# Altium project Radio_Motherboard.PrjPcb
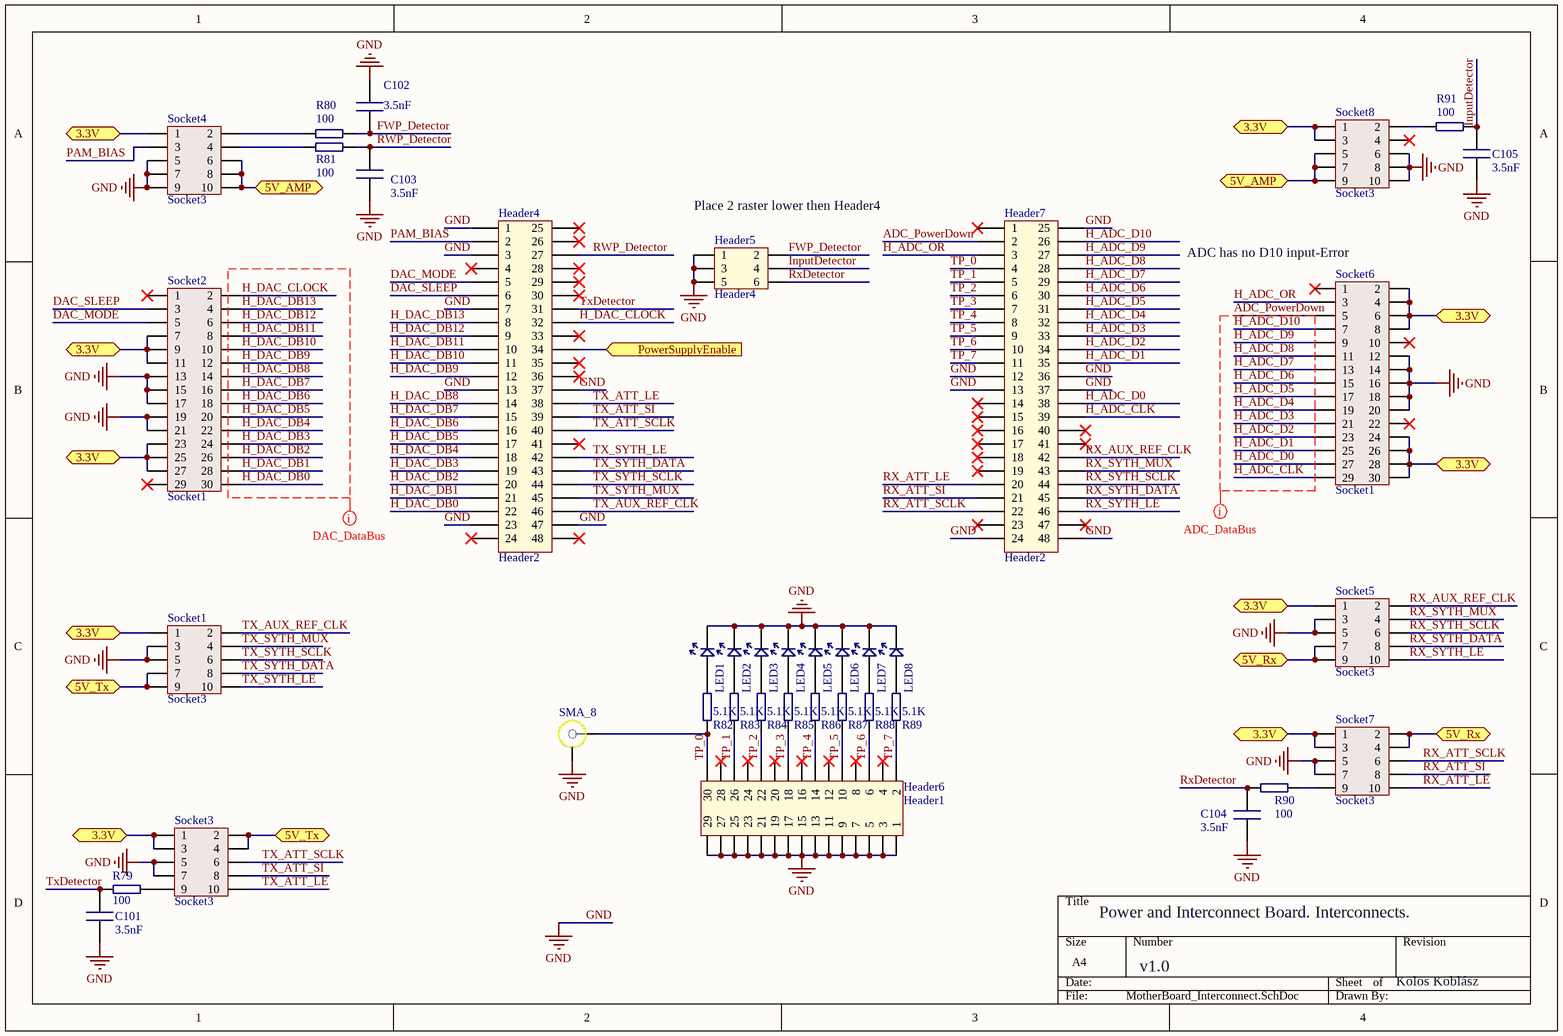
[diagram p0: MotherBoard_Interconnect.SchDoc]
2 sheets, 105 parts. Net scope: flat (ports and power ports of the same name join across sheets).
Board file: PCB_Motherboard.PcbDoc
Sheets:
  MotherBoard_Interconnect.SchDoc
  MotherBoard_PowerSupply.SchDoc

## Sheet MotherBoard_Interconnect.SchDoc
size A4; DocumentNumber: 3; SheetNumber: 3; SheetTotal: 9

### Parts
C101  value 3.5nF  [0805 SMD Passive]  (hidden comment: Cap1)
C102  value 3.5nF  [0805 SMD Passive]  (hidden comment: Cap1)
C103  value 3.5nF  [0805 SMD Passive]  (hidden comment: Cap1)
C104  value 3.5nF  [0805 SMD Passive]  (hidden comment: Cap1)
C105  value 3.5nF  [0805 SMD Passive]  (hidden comment: Cap1)
Header4  Header2  [Header2]
Header5  Header4  [Header4]
Header6  Header1  [Header1]
Header7  Header2  [Header2]
LED1  TP0  [0805 SMD Passive]  (value not drawn)
LED2  TP1  [0805 SMD Passive]  (value not drawn)
LED3  TP2  [0805 SMD Passive]  (value not drawn)
LED4  TP3  [0805 SMD Passive]  (value not drawn)
LED5  TP4  [0805 SMD Passive]  (value not drawn)
LED6  TP5  [0805 SMD Passive]  (value not drawn)
LED7  TP6  [0805 SMD Passive]  (value not drawn)
LED8  TP7  [0805 SMD Passive]  (value not drawn)
R79  value 100  [0805 SMD Passive]  (hidden comment: Resistor)
R80  value 100  [0805 SMD Passive]  (hidden comment: Resistor)
R81  value 100  [0805 SMD Passive]  (hidden comment: Resistor)
R82  value 5.1K  [0805 SMD Passive]  (hidden comment: Resistor)
R83  value 5.1K  [0805 SMD Passive]  (hidden comment: Resistor)
R84  value 5.1K  [0805 SMD Passive]  (hidden comment: Resistor)
R85  value 5.1K  [0805 SMD Passive]  (hidden comment: Resistor)
R86  value 5.1K  [0805 SMD Passive]  (hidden comment: Resistor)
R87  value 5.1K  [0805 SMD Passive]  (hidden comment: Resistor)
R88  value 5.1K  [0805 SMD Passive]  (hidden comment: Resistor)
R89  value 5.1K  [0805 SMD Passive]  (hidden comment: Resistor)
R90  value 100  [0805 SMD Passive]  (hidden comment: Resistor)
R91  value 100  [0805 SMD Passive]  (hidden comment: Resistor)
SMA_8  SMA_2  [SMA_Board]  (value not drawn)
Socket1  Socket3  [Socket3]
Socket2  Socket1  [Socket1]
Socket3  Socket3  [Socket3]
Socket4  Socket3  [Socket3]
Socket5  Socket3  [Socket3]
Socket6  Socket1  [Socket1]
Socket7  Socket3  [Socket3]
Socket8  Socket3  [Socket3]

### Ports
3.3V, 5V_AMP, 5V_Rx, 5V_Tx, PowerSupplyEnable

### Nets
GND: C101.2 C102.2 C103.2 C104.2 C105.2 Header4.1 Header4.3 Header4.7 Header4.13 Header4.23 Header4.37 Header4.47 Header5.1 Header5.3 Header5.5 Header6.1 Header6.3 Header6.5 Header6.7 Header6.9 Header6.11 Header6.13 Header6.15 Header6.17 Header6.19 Header6.21 Header6.23 Header6.25 Header6.27 Header6.29 Header7.12 Header7.13 Header7.24 Header7.25 Header7.36 Header7.37 Header7.48 LED1.1(K) LED2.1(K) LED3.1(K) LED4.1(K) LED5.1(K) LED6.1(K) LED7.1(K) LED8.1(K) SMA_8.2 Socket1.3 Socket1.5 Socket2.13 Socket2.15 Socket2.17 Socket2.19 Socket2.21 Socket3.5 Socket3.7 Socket4.5 Socket4.7 Socket4.9 Socket5.3 Socket5.5 Socket6.12 Socket6.14 Socket6.16 Socket6.18 Socket6.20 Socket7.5 Socket7.7 Socket8.6 Socket8.8 Socket8.10
3.3V: Socket1.1 Socket2.7 Socket2.9 Socket2.11 Socket2.23 Socket2.25 Socket2.27 Socket3.1 Socket3.3 Socket4.1 Socket5.1 Socket6.2 Socket6.4 Socket6.6 Socket6.8 Socket6.24 Socket6.26 Socket6.28 Socket6.30 Socket7.1 Socket7.3 Socket8.1 Socket8.3 ; port 3.3V
5V_Amp: Socket4.6 Socket4.8 Socket4.10 Socket8.5 Socket8.7 Socket8.9 ; port 5V_AMP
5V_Rx: Socket5.7 Socket5.9 Socket7.2 Socket7.4 ; port 5V_Rx
5V_Tx: Socket1.7 Socket1.9 Socket3.2 Socket3.4 ; port 5V_Tx
ADC_PowerDown: Header7.2 Socket6.5
DAC_MODE: Header4.5 Socket2.5
DAC_SLEEP: Header4.6 Socket2.3
FWP_Detector: C102.1 Header5.2 R80.2
H_ADC_CLK: Header7.39 Socket6.29
H_ADC_D0: Header7.38 Socket6.27
H_ADC_D1: Header7.35 Socket6.25
H_ADC_D2: Header7.34 Socket6.23
H_ADC_D3: Header7.33 Socket6.21
H_ADC_D4: Header7.32 Socket6.19
H_ADC_D5: Header7.31 Socket6.17
H_ADC_D6: Header7.30 Socket6.15
H_ADC_D7: Header7.29 Socket6.13
H_ADC_D8: Header7.28 Socket6.11
H_ADC_D9: Header7.27 Socket6.9
H_ADC_D10: Header7.26 Socket6.7
H_ADC_OR: Header7.3 Socket6.3
H_DAC_CLOCK: Header4.32 Socket2.2
H_DAC_DB0: Header4.22 Socket2.30
H_DAC_DB1: Header4.21 Socket2.28
H_DAC_DB2: Header4.20 Socket2.26
H_DAC_DB3: Header4.19 Socket2.24
H_DAC_DB4: Header4.18 Socket2.22
H_DAC_DB5: Header4.17 Socket2.20
H_DAC_DB6: Header4.16 Socket2.18
H_DAC_DB7: Header4.15 Socket2.16
H_DAC_DB8: Header4.14 Socket2.14
H_DAC_DB9: Header4.12 Socket2.12
H_DAC_DB10: Header4.11 Socket2.10
H_DAC_DB11: Header4.10 Socket2.8
H_DAC_DB12: Header4.9 Socket2.6
H_DAC_DB13: Header4.8 Socket2.4
InputDetector: C105.1 Header5.4 R91.1
PAM_BIAS: Header4.2 Socket4.3
RWP_Detector: C103.1 Header4.27 R81.2
RX_ATT_LE: Header7.20 Socket7.10
RX_ATT_SCLK: Header7.22 Socket7.6
RX_ATT_SI: Header7.21 Socket7.8
RX_AUX_REF_CLK: Header7.42 Socket5.2
RX_SYTH_DATA: Header7.45 Socket5.8
RX_SYTH_LE: Header7.46 Socket5.10
RX_SYTH_MUX: Header7.43 Socket5.4
RX_SYTH_SCLK: Header7.44 Socket5.6
RxDetector: C104.1 Header5.6 R90.1
TP_0: Header6.30 Header7.4 R82.1 SMA_8.1
TP_1: Header6.26 Header7.5 R83.1
TP_2: Header6.22 Header7.6 R84.1
TP_3: Header6.18 Header7.7 R85.1
TP_4: Header6.14 Header7.8 R86.1
TP_5: Header6.10 Header7.9 R87.1
TP_6: Header6.6 Header7.10 R88.1
TP_7: Header6.2 Header7.11 R89.1
TX_ATT_LE: Header4.38 Socket3.10
TX_ATT_SCLK: Header4.40 Socket3.6
TX_ATT_SI: Header4.39 Socket3.8
TX_AUX_REF_CLK: Header4.46 Socket1.2
TX_SYTH_DATA: Header4.43 Socket1.8
TX_SYTH_LE: Header4.42 Socket1.10
TX_SYTH_MUX: Header4.45 Socket1.4
TX_SYTH_SCLK: Header4.44 Socket1.6
TxDetector: C101.1 Header4.31 R79.1
NetHeader4_34: Header4.34 ; port PowerSupplyEnable
NetLED1_2: LED1.2(A) R82.2
NetLED2_2: LED2.2(A) R83.2
NetLED3_2: LED3.2(A) R84.2
NetLED4_2: LED4.2(A) R85.2
NetLED5_2: LED5.2(A) R86.2
NetLED6_2: LED6.2(A) R87.2
NetLED7_2: LED7.2(A) R88.2
NetLED8_2: LED8.2(A) R89.2
NetR79_2: R79.2 Socket3.9
NetR80_1: R80.1 Socket4.2
NetR81_1: R81.1 Socket4.4
NetR90_2: R90.2 Socket7.9
NetR91_2: R91.2 Socket8.2

Not connected (* = marked no-connect by the designer): Header4 4* 24* 25* 26* 28* 29* 30* 33* 35* 36* 41* 48*; Header6 4* 8* 12* 16* 20* 24* 28*; Header7 1* 14* 15* 16* 17* 18* 19* 23* 40* 41* 47*; Socket2 1* 29*; Socket6 1* 10* 22*; Socket8 4*

### Layout directives
net class ADC_DataBus: ADC_PowerDown, H_ADC_CLK, H_ADC_D0, H_ADC_D1, H_ADC_D2, H_ADC_D3, H_ADC_D4, H_ADC_D5, H_ADC_D6, H_ADC_D7, H_ADC_D8, H_ADC_D9, H_ADC_D10
net class DAC_DataBus: H_DAC_CLOCK, H_DAC_DB0, H_DAC_DB1, H_DAC_DB2, H_DAC_DB3, H_DAC_DB4, H_DAC_DB5, H_DAC_DB6, H_DAC_DB7, H_DAC_DB8, H_DAC_DB9, H_DAC_DB10, H_DAC_DB11, H_DAC_DB12, H_DAC_DB13

### Notes on the sheet
- (near Header5) Place 2 raster lower then Header4
- (near Socket6) ADC has no D10 input-Error
- Power and Interconnect Board. Interconnects.
- v1.0
- Kolos Koblász

### Library data of the parts
C101-C105 = Cap1: SMD Capacitor; Precision: 1%; MaxVolt: 16V; FootPrint: *
Header4 Header7 = Header2: 48 Pin Header; PinNumber: 48; Row: 2; Pitch: 2.54mm; Type: 180°; Digi Key Order Code: 3M156386-48-ND
Header5 = Header4: 6pin DIL header; PinNumber: 6; Row: 2; Pitch: 2.54mm; Type: Straight
Header6 = Header1: 29 Pin Header; PartNumber: TLW-115-01-G-D-002-RA; Manufacterer: Samtec; PinNumber: 29; Row: 2; Pitch: 2.54mm; Type: 90°
LED1 LED8 = LED_Green: Diode; Manufacturer: LITEON; Partnumber: LTST-C171KGKT; Type: Green; MaxForwardCurrent: 30mA; MaxRevVoltage: 5V; ForwardCurrent: 20mA; ForwardVoltage: 2V; OrderCode: 160-1426-1-ND; Footprint: 0805
LED2-LED7 = LED_Green: Diode; Manufacturer: LITEON; Partnumber: LTST-C171KGKT; Type: Green; OrderCode: 160-1426-1-ND; MaxForwardCurrent: 30mA; MaxRevVoltage: 5V; ForwardCurrent: 20mA; ForwardVoltage: 2V; Footprint: 0805
R79-R91 = Res1: SMD Resistor; Precision: 1%; MaxPower: 0.1W; FootPrint: SMD
SMA_8 = SMA_2: SMA Female; Shape: Straight; Footprint: *; PartNumber: *; Manufacturer: *; OrderCode: *; Mounting: TroughHole
Socket1 Socket3-Socket5 Socket7 Socket8 = Socket3: 10 Pin Socket; PinNumber: 10; Row: 2; Pitch: 2.54mm; Type: 180°
Socket2 Socket6 = Socket1: 30 Pin Socket; PartNumber: SLW-115-01-G-D; Manufacterer: Samtec; PinNumber: 30; Row: 2; Pitch: 2.54mm; Type: 180°

## Sheet MotherBoard_PowerSupply.SchDoc
size A4; DocumentNumber: 6; SheetNumber: 6; SheetTotal: 9
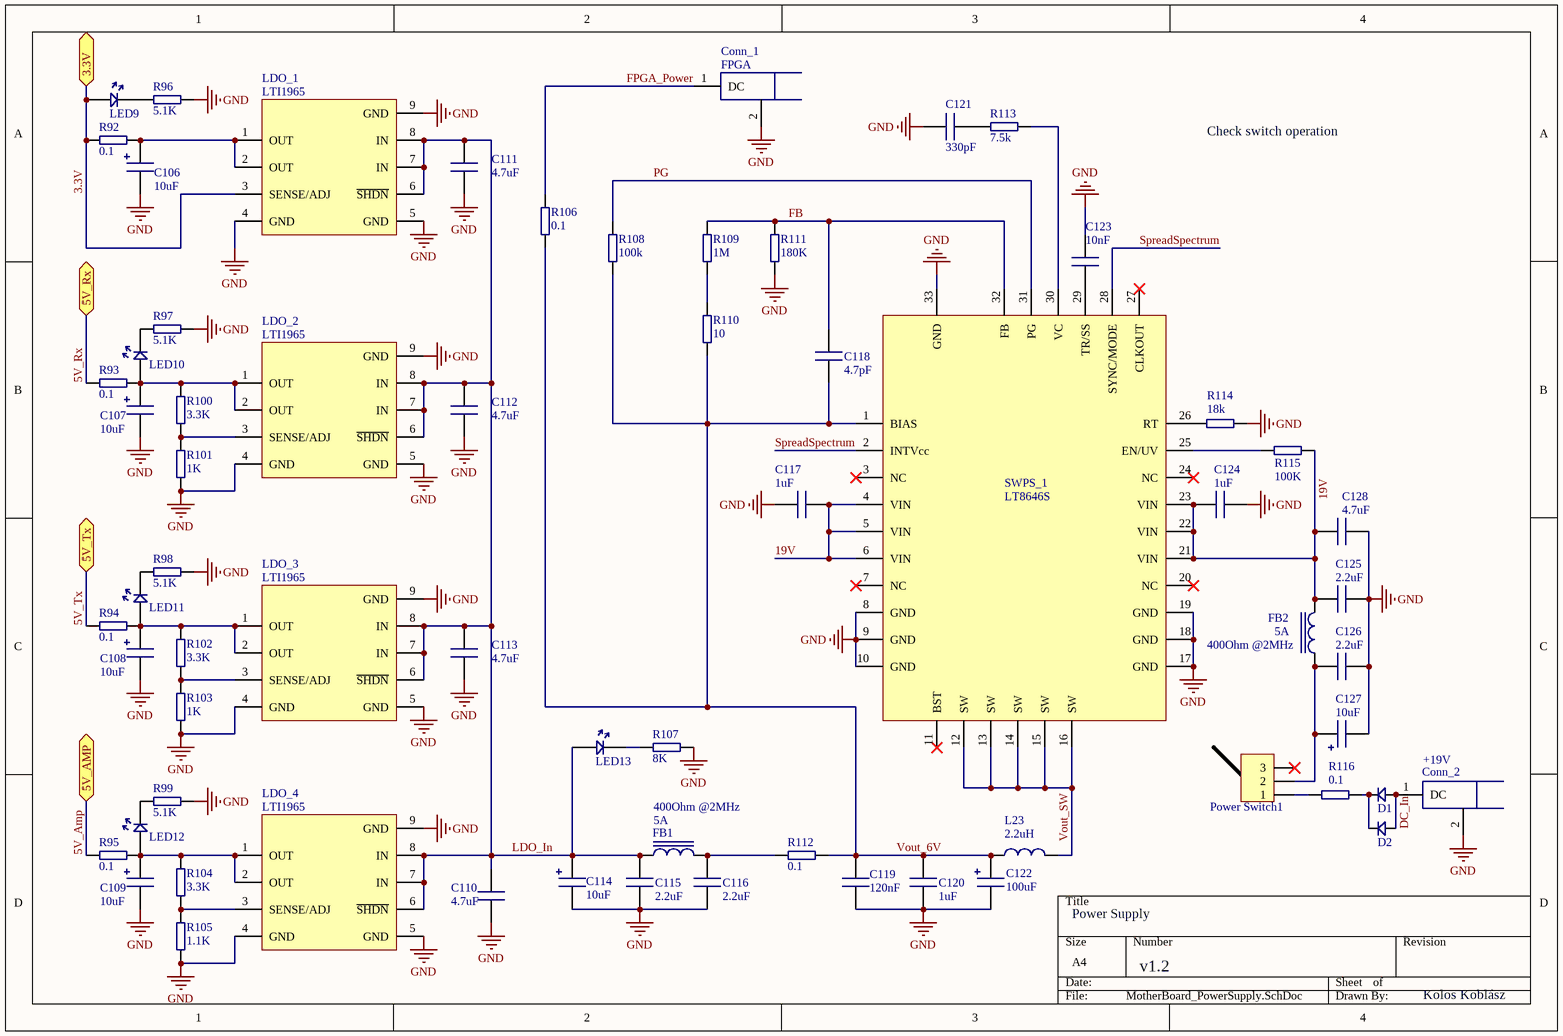
[diagram p1: MotherBoard_PowerSupply.SchDoc]

### Parts
C106  value 10uF  [ELKO_CAP]  (hidden comment: Cap2)
C107  value 10uF  [ELKO_CAP]  (hidden comment: Cap2)
C108  value 10uF  [ELKO_CAP]  (hidden comment: Cap2)
C109  value 10uF  [ELKO_CAP]  (hidden comment: Cap2)
C110  value 4.7uF  [0805 SMD Passive]  (hidden comment: Cap1)
C111  value 4.7uF  [0805 SMD Passive]  (hidden comment: Cap1)
C112  value 4.7uF  [0805 SMD Passive]  (hidden comment: Cap1)
C113  value 4.7uF  [0805 SMD Passive]  (hidden comment: Cap1)
C114  value 10uF  [ELKO_CAP]  (hidden comment: Cap2)
C115  value 2.2uF  [0805 SMD Passive]  (hidden comment: Cap1)
C116  value 2.2uF  [0805 SMD Passive]  (hidden comment: Cap1)
C117  value 1uF  [0805 SMD Passive]  (hidden comment: Cap1)
C118  value 4.7pF  [0805 SMD Passive]  (hidden comment: Cap1)
C119  value 120nF  [0805 SMD Passive]  (hidden comment: Cap1)
C120  value 1uF  [0805 SMD Passive]  (hidden comment: Cap1)
C121  value 330pF  [0805 SMD Passive]  (hidden comment: Cap1)
C122  value 100uF  [ELKO_CAP]  (hidden comment: Cap2)
C123  value 10nF  [0805 SMD Passive]  (hidden comment: Cap1)
C124  value 1uF  [0805 SMD Passive]  (hidden comment: Cap1)
C125  value 2.2uF  [0805 SMD Passive]  (hidden comment: Cap1)
C126  value 2.2uF  [0805 SMD Passive]  (hidden comment: Cap1)
C127  value 10uF  [ELKO_CAP]  (hidden comment: Cap2)
C128  value 4.7uF  [0805 SMD Passive]  (hidden comment: Cap1)
Conn_1  FPGA  [DC_Connector]
Conn_2  +19V  [DC_Connector]
D1  Diode1  [SMB]  (value not drawn)
D2  Diode1  [SMB]  (value not drawn)
FB1  value 400Ohm @2MHz  MaxCurent: 5A  [FerritBead]  (hidden comment: Ferrit Bead)
FB2  value 400Ohm @2MHz  MaxCurent: 5A  [FerritBead]  (hidden comment: Ferrit Bead)
L23  value 2.2uH  [SMD Inductor]  (hidden comment: Inductor)
LDO_1  LTI1965  [LT1965]
LDO_2  LTI1965  [LT1965]
LDO_3  LTI1965  [LT1965]
LDO_4  LTI1965  [LT1965]
LED9  +3.3V  [0805 SMD Passive]  (value not drawn)
LED10  +5V Rx  [0805 SMD Passive]  (value not drawn)
LED11  +5V Tx  [0805 SMD Passive]  (value not drawn)
LED12  +5V AMP  [0805 SMD Passive]  (value not drawn)
LED13  +6V  [0805 SMD Passive]  (value not drawn)
Power_Switch1  Switch  [Switch]  (value not drawn)
R92  value 0.1  [0805 SMD Passive]  (hidden comment: Resistor)
R93  value 0.1  [0805 SMD Passive]  (hidden comment: Resistor)
R94  value 0.1  [0805 SMD Passive]  (hidden comment: Resistor)
R95  value 0.1  [0805 SMD Passive]  (hidden comment: Resistor)
R96  value 5.1K  [0805 SMD Passive]  (hidden comment: Resistor)
R97  value 5.1K  [0805 SMD Passive]  (hidden comment: Resistor)
R98  value 5.1K  [0805 SMD Passive]  (hidden comment: Resistor)
R99  value 5.1K  [0805 SMD Passive]  (hidden comment: Resistor)
R100  value 3.3K  [0805 SMD Passive]  (hidden comment: Resistor)
R101  value 1K  [0805 SMD Passive]  (hidden comment: Resistor)
R102  value 3.3K  [0805 SMD Passive]  (hidden comment: Resistor)
R103  value 1K  [0805 SMD Passive]  (hidden comment: Resistor)
R104  value 3.3K  [0805 SMD Passive]  (hidden comment: Resistor)
R105  value 1.1K  [0805 SMD Passive]  (hidden comment: Resistor)
R106  value 0.1  [0805 SMD Passive]  (hidden comment: Resistor)
R107  value 8K  [0805 SMD Passive]  (hidden comment: Resistor)
R108  value 100k  [0805 SMD Passive]  (hidden comment: Resistor)
R109  value 1M  [0805 SMD Passive]  (hidden comment: Resistor)
R110  value 10  [0805 SMD Passive]  (hidden comment: Resistor)
R111  value 180K  [0805 SMD Passive]  (hidden comment: Resistor)
R112  value 0.1  [0805 SMD Passive]  (hidden comment: Resistor)
R113  value 7.5k  [0805 SMD Passive]  (hidden comment: Resistor)
R114  value 18k  [0805 SMD Passive]  (hidden comment: Resistor)
R115  value 100K  [0805 SMD Passive]  (hidden comment: Resistor)
R116  value 0.1  [0805 SMD Passive]  (hidden comment: Resistor)
SWPS_1  LT8646S  [LT8646S]

### Ports
3.3V, 5V_AMP, 5V_Rx, 5V_Tx

### Nets
GND: C106.2 C107.2 C108.2 C109.2 C110.1 C111.1 C112.1 C113.1 C114.2 C115.1 C116.1 C117.2 C119.2 C120.2 C121.1 C122.2 C123.1 C124.2 C125.1 C126.1 C127.2 C128.1 Conn_1.2(GND) Conn_2.2(GND) LDO_1.4(GND) LDO_1.5(GND) LDO_1.9(GND) LDO_2.4(GND) LDO_2.5(GND) LDO_2.9(GND) LDO_3.4(GND) LDO_3.5(GND) LDO_3.9(GND) LDO_4.4(GND) LDO_4.5(GND) LDO_4.9(GND) R96.2 R97.2 R98.2 R99.2 R101.1 R103.1 R105.1 R107.2 R111.2 R114.2 SWPS_1.8(GND) SWPS_1.9(GND) SWPS_1.10(GND) SWPS_1.17(GND) SWPS_1.18(GND) SWPS_1.19(GND) SWPS_1.33(GND)
3.3V: LDO_1.3(SENSE/ADJ) LED9.2(A) R92.1 ; port 3.3V
5V_Amp: R95.1 ; port 5V_AMP
5V_Rx: R93.1 ; port 5V_Rx
5V_Tx: R94.1 ; port 5V_Tx
19V: C117.1 C124.1 C125.2 C128.2 FB2.1 R115.1 SWPS_1.4(VIN) SWPS_1.5(VIN) SWPS_1.6(VIN) SWPS_1.21(VIN) SWPS_1.22(VIN) SWPS_1.23(VIN)
DC_In: Conn_2.1(DC) D1.2(A) D2.2(A)
FB: C118.1 R109.1 R111.1 SWPS_1.32(FB)
FPGA_Power: Conn_1.1(DC) R106.1
LDO_In: C110.2 C111.2 C112.2 C113.2 C114.1 C115.2 FB1.1 LDO_1.6(~{SHDN}) LDO_1.7(IN) LDO_1.8(IN) LDO_2.6(~{SHDN}) LDO_2.7(IN) LDO_2.8(IN) LDO_3.6(~{SHDN}) LDO_3.7(IN) LDO_3.8(IN) LDO_4.6(~{SHDN}) LDO_4.7(IN) LDO_4.8(IN) LED13.2(A)
PG: R108.1 SWPS_1.31(PG)
SpreadSpectrum: SWPS_1.2(INTVcc) SWPS_1.28(SYNC/MODE)
Vout_6V: C118.2 C119.1 C120.1 C122.1 L23.1 R106.2 R108.2 R110.2 R112.2 SWPS_1.1(BIAS)
Vout_SW: L23.2 SWPS_1.12(SW) SWPS_1.13(SW) SWPS_1.14(SW) SWPS_1.15(SW) SWPS_1.16(SW)
NetC106_1: C106.1 LDO_1.1(OUT) LDO_1.2(OUT) R92.2
NetC107_1: C107.1 LDO_2.1(OUT) LDO_2.2(OUT) LED10.2(A) R93.2 R100.2
NetC108_1: C108.1 LDO_3.1(OUT) LDO_3.2(OUT) LED11.2(A) R94.2 R102.2
NetC109_1: C109.1 LDO_4.1(OUT) LDO_4.2(OUT) LED12.2(A) R95.2 R104.2
NetC116_2: C116.2 FB1.2 R112.1
NetC121_2: C121.2 R113.1
NetC123_2: C123.2 SWPS_1.29(TR/SS)
NetC126_2: C126.2 C127.1 FB2.2 Power_Switch1.2
NetD1_1: D1.1(K) D2.1(K) R116.1
NetLDO_2_3: LDO_2.3(SENSE/ADJ) R100.1 R101.2
NetLDO_3_3: LDO_3.3(SENSE/ADJ) R102.1 R103.2
NetLDO_4_3: LDO_4.3(SENSE/ADJ) R104.1 R105.2
NetLED9_1: LED9.1(K) R96.1
NetLED10_1: LED10.1(K) R97.1
NetLED11_1: LED11.1(K) R98.1
NetLED12_1: LED12.1(K) R99.1
NetLED13_1: LED13.1(K) R107.1
NetPower_Switch1_1: Power_Switch1.1 R116.2
NetR109_2: R109.2 R110.1
NetR113_2: R113.2 SWPS_1.30(VC)
NetR114_1: R114.1 SWPS_1.26(RT)
NetR115_2: R115.2 SWPS_1.25(EN/UV)

Not connected (* = marked no-connect by the designer): Power_Switch1 3*; SWPS_1 3(NC)* 7(NC)* 11(BST)* 20(NC)* 24(NC)* 27(CLKOUT)*

### Notes on the sheet
- Check switch operation
- Power Supply
- v1.2
- Kolos Koblász

### Library data of the parts
C106-C109 C114 C122 C127 = Cap2: SMD Polarized Capacitor; Precision: 20%; MaxVolt: 16V; FootPrint: *
C110-C113 C115-C121 C123-C126 C128 = Cap1: SMD Capacitor; Precision: 5%; MaxVolt: 16V; FootPrint: *
Conn_1 Conn_2 = DC_Connector: Coaxial DC connector - female; Manufacturer: *; Size: *; Vmax: *; Imax: *
D1 = Diode1: Diode; Partnumber: DO-2144AA; MaxForwardCurrent: 100mA; MaxRevVoltage: 2A; Manufacturer: *; Type: *; OrderCode: 83-02-51
D2 = Diode1: Diode; Partnumber: DO-214AA; MaxForwardCurrent: 2A; MaxRevVoltage: 1000V; Manufacturer: *; Type: *; OrderCode: 83-02-51
FB1 FB2 = FerritBead: PartNumber: FB20022-4B-RC; Precision: 10%; FootPrint: THD; Digi Key Order Code: FB20022-4B-RC-ND
L23 = Ind1: SMD Inductor; Manufacturer: Coilcraft; PartNumber: XEL-4030-222; Precision: 20%; MaxCurent: 5A
LDO_1 = LTI1965: Low Dropout Linear Regulator; Manufacturer: Analog Devices; Order Code: LT1965EDD-3.3#PBF; Package Description: 8-Lead Plastic DFN; PartNumber: LTI1965; Version: Fix 3.3V
LDO_2-LDO_4 = LTI1965: Low Dropout Linear Regulator; Manufacturer: Analog Devices; Order Code: LT1965EDD#PBF; Package Description: 8-Lead Plastic DFN; PartNumber: LTI1965; Version: Adjustable
LED9-LED13 = LED_Green: as LED1 on sheet MotherBoard_Interconnect; Footprint: 0805
Power_Switch1 = Switch: 3 state switch; PinNumber: 3; Pitch: 2.54mm; Type: THD 3 state; Digi Key Order Code: EG2355-ND
R92-R116 = Res1: as R79 on sheet MotherBoard_Interconnect; FootPrint: SMD
SWPS_1 = LT8646S: Step-Down Silent Switcher Power Supply; Manufacturer: Analog Devices; Order Code: LT8646SEV#PBF; Package Description: LQFN; PartNumber: LT8646S

## Nets that join several sheets
GND: MotherBoard_Interconnect (70 pins), MotherBoard_PowerSupply (53 pins)
3.3V: MotherBoard_Interconnect (23 pins), MotherBoard_PowerSupply (LDO_1.3 LED9.2 R92.1)
5V_Amp: MotherBoard_Interconnect (6 pins), MotherBoard_PowerSupply (R95.1)
5V_Rx: MotherBoard_Interconnect (Socket5.7 Socket5.9 Socket7.2 Socket7.4), MotherBoard_PowerSupply (R93.1)
5V_Tx: MotherBoard_Interconnect (Socket1.7 Socket1.9 Socket3.2 Socket3.4), MotherBoard_PowerSupply (R94.1)